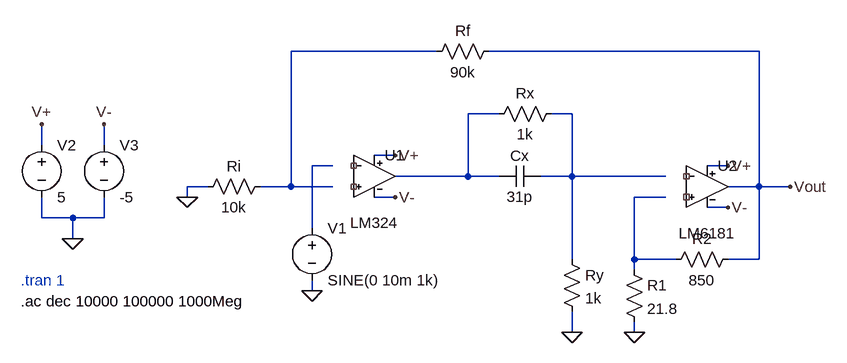
[diagram p0: schematic VFA_CFA_compensado.asc]
VFA_CFA_compensado.asc, the LTspice schematic file:
Version 4
SHEET 1 880 680
WIRE -144 -48 -368 -48
WIRE 352 -48 -64 -48
WIRE -48 48 -96 48
WIRE 64 48 32 48
WIRE -752 96 -752 64
WIRE -656 96 -656 64
WIRE -208 112 -240 112
WIRE -304 128 -336 128
WIRE 304 128 272 128
WIRE -96 144 -96 48
WIRE -96 144 -208 144
WIRE -48 144 -96 144
WIRE 64 144 64 48
WIRE 64 144 16 144
WIRE 208 144 64 144
WIRE -496 160 -528 160
WIRE -368 160 -368 -48
WIRE -368 160 -416 160
WIRE -304 160 -368 160
WIRE 352 160 352 -48
WIRE 352 160 304 160
WIRE 400 160 352 160
WIRE -528 176 -528 160
WIRE -208 176 -240 176
WIRE 208 176 160 176
WIRE 304 192 272 192
WIRE -752 208 -752 176
WIRE -704 208 -752 208
WIRE -656 208 -656 176
WIRE -656 208 -704 208
WIRE -336 224 -336 128
WIRE -704 240 -704 208
WIRE 64 272 64 144
WIRE 160 272 160 176
WIRE 224 272 160 272
WIRE 352 272 352 160
WIRE 352 272 304 272
WIRE 160 288 160 272
WIRE -336 320 -336 304
WIRE 64 384 64 352
WIRE 160 384 160 368
FLAG -528 176 0
FLAG -336 320 0
FLAG 160 384 0
FLAG 400 160 Vout
FLAG -208 112 V+
FLAG 304 128 V+
FLAG -208 176 V-
FLAG 304 192 V-
FLAG -704 240 0
FLAG -656 64 V-
FLAG -752 64 V+
FLAG 64 384 0
SYMBOL AutoGenerated\\LM324 -240 144 R0
SYMATTR InstName U1
SYMBOL res 144 272 R0
SYMATTR InstName R1
SYMATTR Value 21.8
SYMBOL res 320 256 R90
WINDOW 0 0 56 VBottom 2
WINDOW 3 32 56 VTop 2
SYMATTR InstName R2
SYMATTR Value 850
SYMBOL res -48 -64 R90
WINDOW 0 0 56 VBottom 2
WINDOW 3 32 56 VTop 2
SYMATTR InstName Rf
SYMATTR Value 90k
SYMBOL res -400 144 R90
WINDOW 0 0 56 VBottom 2
WINDOW 3 32 56 VTop 2
SYMATTR InstName Ri
SYMATTR Value 10k
SYMBOL voltage -336 208 R0
WINDOW 39 0 0 Left 0
SYMATTR Value2 AC 1 0
SYMATTR InstName V1
SYMATTR Value SINE(0 10m 1k)
SYMBOL voltage -752 80 R0
WINDOW 123 0 0 Left 0
WINDOW 39 0 0 Left 0
SYMATTR InstName V2
SYMATTR Value 5
SYMBOL voltage -656 80 R0
WINDOW 123 0 0 Left 0
WINDOW 39 0 0 Left 0
SYMATTR InstName V3
SYMATTR Value -5
SYMBOL AutoGenerated\\LM6181 272 160 R0
SYMATTR InstName U2
SYMBOL cap 16 128 R90
WINDOW 0 0 32 VBottom 2
WINDOW 3 32 32 VTop 2
SYMATTR InstName Cx
SYMATTR Value 31p
SYMBOL res 48 256 R0
SYMATTR InstName Ry
SYMATTR Value 1k
SYMBOL res 48 32 R90
WINDOW 0 0 56 VBottom 2
WINDOW 3 32 56 VTop 2
SYMATTR InstName Rx
SYMATTR Value 1k
TEXT -784 304 Left 2 ;.tran 1
TEXT -784 336 Left 2 !.ac dec 10000 100000 1000Meg

The netlist it stands for:
* VFA_CFA_compensado.asc
XU1 NC_01 NC_02 V+ V- N002 LM324  ; pins In+ In- V+ V- OUT
R1 N005 0 21.8
R2 Vout N005 850
Rf Vout N001 90k
Ri N001 0 10k
V1 N004 0 SINE(0 10m 1k) AC 1 0
V2 V+ 0 5
V3 V- 0 -5
XU2 NC_03 NC_04 V+ V- Vout LM6181  ; pins In+ In- V+ V- OUT
Cx N003 N002 31p
Ry N003 0 1k
Rx N003 N002 1k
* .tran 1
.ac dec 10000 100000 1000Meg
.lib E:\LtSpice_components\LM324.ti.lib
.lib E:\LtSpice_components\LM6181.lib
.backanno
.end